# Altium schematic sheet Processor_Interface.SchDoc
size A4; SheetNumber: 4; SheetTotal: 5
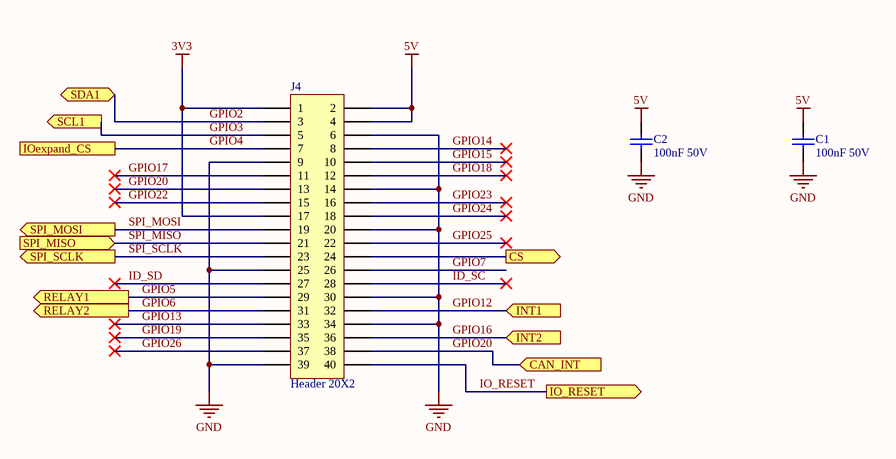
[diagram p0: Processor_Interface.SchDoc]

## Parts
C1  100nF 50V  [0603C_L]
C2  100nF 50V  [0603C_L]
J4  Header 20X2  [HDR2X20]

## Ports
CAN_INT (in), CS (out), INT1 (in), INT2 (in), IO_RESET (out), IOexpand_CS, RELAY1 (out), RELAY2 (out), SCL1 (out), SDA1 (bidir), SPI_MISO (in), SPI_MOSI (out), SPI_SCLK (out)

## Nets
3V3: J4.1 J4.17
5V: C1.2 C2.2 J4.2 J4.4
GND: C1.1 C2.1 J4.6 J4.9 J4.14 J4.20 J4.25 J4.30 J4.34 J4.39
CS: J4.24 ; port CS
GPIO2: J4.3 ; port SDA1
GPIO3: J4.5 ; port SCL1
GPIO4: J4.7 ; port IOexpand_CS
GPIO5: J4.29 ; port RELAY1
GPIO6: J4.31 ; port RELAY2
GPIO7: J4.26
GPIO12: J4.32 ; port INT1
GPIO13: J4.33
GPIO14: J4.8
GPIO15: J4.10
GPIO16: J4.36 ; port INT2
GPIO17: J4.11
GPIO18: J4.12
GPIO19: J4.35
GPIO20: J4.13 J4.38 ; port CAN_INT
GPIO22: J4.15
GPIO23: J4.16
GPIO24: J4.18
GPIO25: J4.22
GPIO26: J4.37
ID_SC: J4.28
ID_SD: J4.27
IO_RESET: J4.40 ; port IO_RESET
SPI_MISO: J4.21 ; port SPI_MISO
SPI_MOSI: J4.19 ; port SPI_MOSI
SPI_SCLK: J4.23 ; port SPI_SCLK

## Library data of the parts
C1 C2 = Cap100nF_50V_0603: Manufacturer: Yageo; Manufacturer Part Number: CC0603ZRY5V9BB104; Capacitance: 0.10µF; Tolerance: -20%, +80%; Temperature Coefficient: Y5V (F); Supplier 1: Digi-Key; Supplier Part Number 1: 311-1343-1-ND; RoHS: RoHS Compliant; Category: Capacitors; Stock 1: 1827128; Pricing 1: 1=0.1, 10=0.018, 25=0.0128, 100=0.0082, 250=0.00672, 500=0.00574, 1000=0.00447 (USD); Packaging: Cut Tape (CT); Part Status: Active; Voltage - Rated: 50V; Operating Temperature: -30°C ~ 85°C; Features: -; Ratings: -; Applications: General Purpose; Failure Rate: -; Mounting Type: Surface Mount, MLCC; Package / Case: 0603 (1608 Metric); Size / Dimension: 0.063" L x 0.031" W (1.60mm x 0.80mm); Height - Seated (Max): -; Thickness (Max): 0.035" (0.90mm); Lead Spacing: -; Lead Style: -; ComponentLink1URL: http://www.yageo.com/documents/recent/UPY-GPHC_Y5V_6.3V-to-50V_6.pdf; ComponentLink1Description: http://www.yageo.com/documents/recent/UPY-GPHC_Y5V_6.3V-to-50V_6.pdf
J4 = Header 20X2: Header, 20-Pin, Dual row; LatestRevisionDate: 17-Jul-2002; LatestRevisionNote: Re-released for DXP Platform.; Publisher: Altium Limited